# EAGLE design switch (EAGLE 4.16)
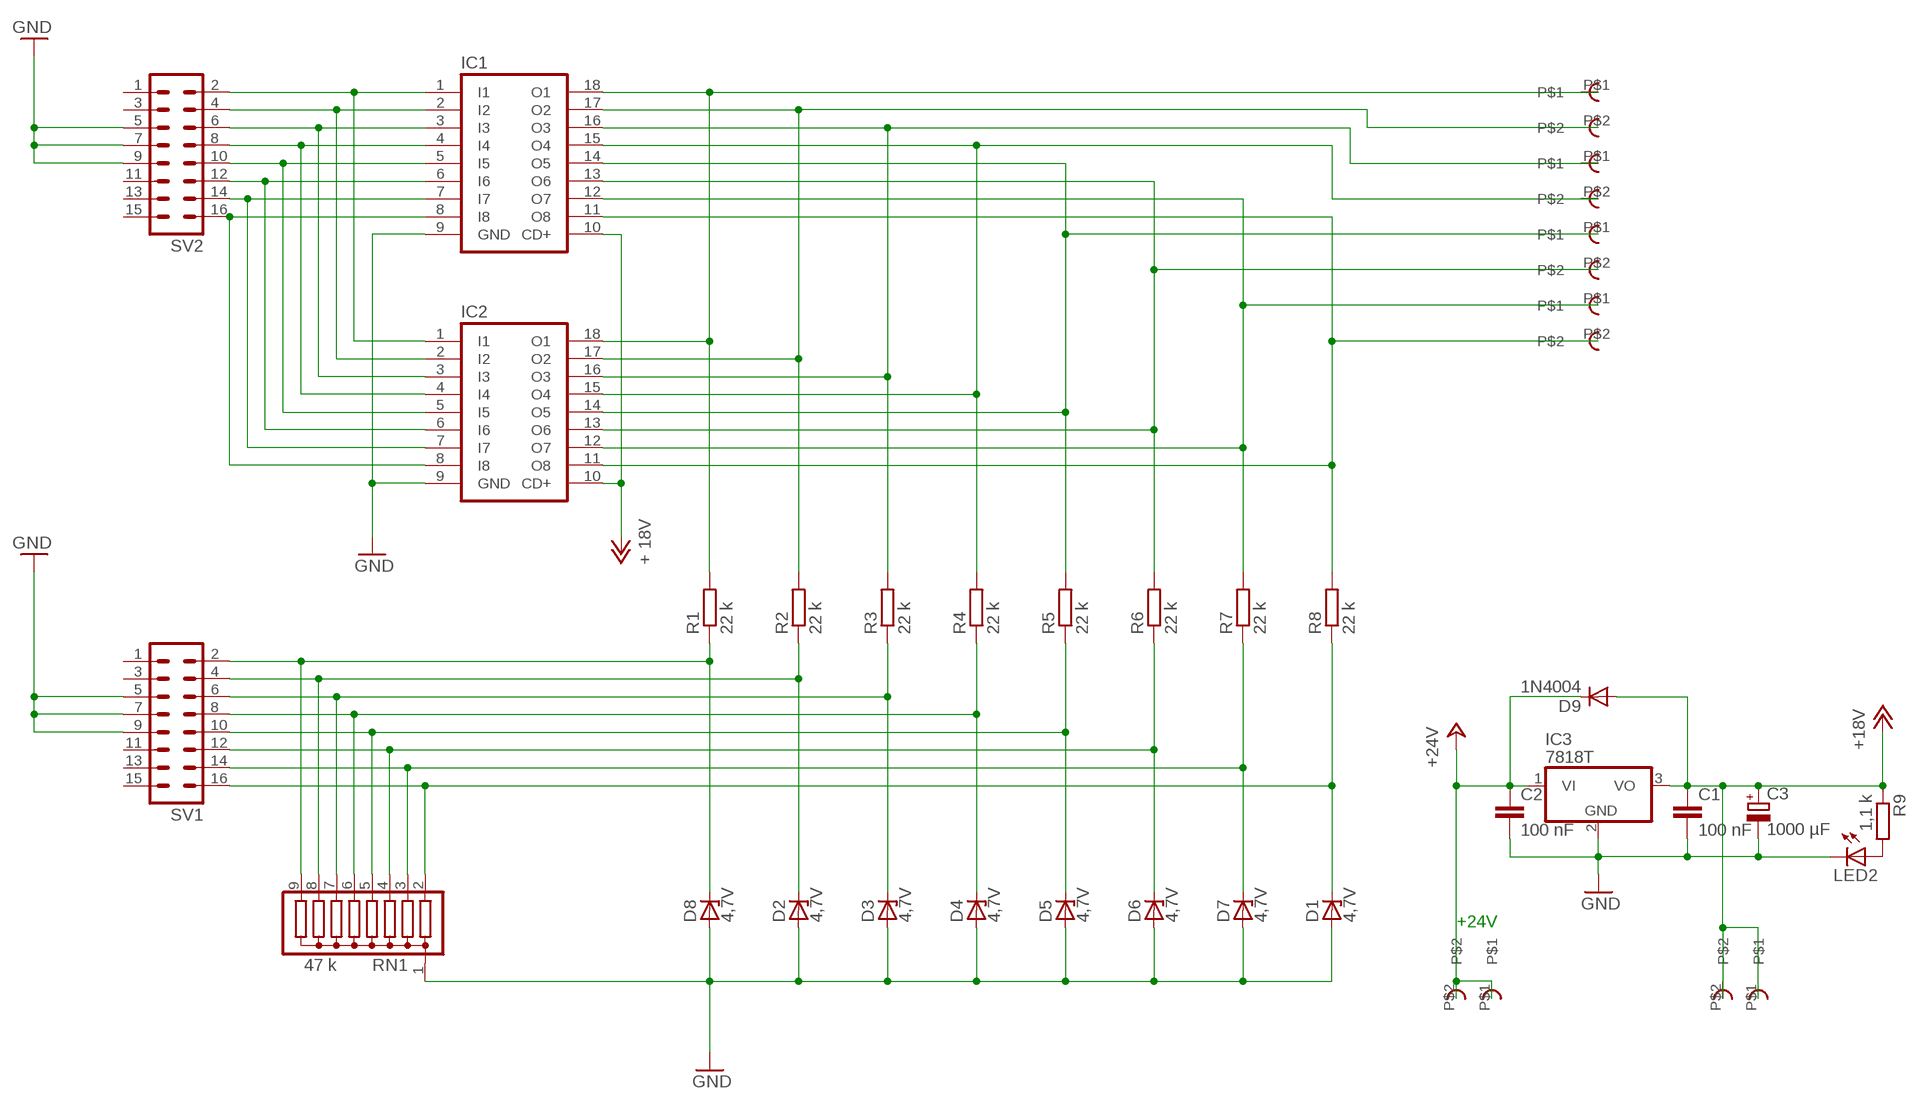
[diagram p0: schematic, sheet 1]

## Parts
+18V  RIACON101-2  [RIACON101-2]
+24V  RIACON101-2  [RIACON101-2]
C1  100 nF  C-EU025-024X044  [C025-024X044]
C2  100 nF  C-EU025-024X044  [C025-024X044]
C3  1000 µF  CPOL-EUE5-10.5  [E5-10,5]
D1  4,7V  ZENER-DIODEDO35Z10  [DO35Z10]
D2  4,7V  ZENER-DIODEDO35Z10  [DO35Z10]
D3  4,7V  ZENER-DIODEDO35Z10  [DO35Z10]
D4  4,7V  ZENER-DIODEDO35Z10  [DO35Z10]
D5  4,7V  ZENER-DIODEDO35Z10  [DO35Z10]
D6  4,7V  ZENER-DIODEDO35Z10  [DO35Z10]
D7  4,7V  ZENER-DIODEDO35Z10  [DO35Z10]
D8  4,7V  ZENER-DIODEDO35Z10  [DO35Z10]
D9  1N4004  [DO41-10]
IC1  ULN2803A  [DIL18]
IC2  ULN2803A  [DIL18]
IC3  7818T  [TO220H]
LED2  LED3MM  [LED3MM]
R1  22 k  R-EU_0207/2V  [0207/2V]
R2  22 k  R-EU_0207/2V  [0207/2V]
R3  22 k  R-EU_0207/2V  [0207/2V]
R4  22 k  R-EU_0207/2V  [0207/2V]
R5  22 k  R-EU_0207/2V  [0207/2V]
R6  22 k  R-EU_0207/2V  [0207/2V]
R7  22 k  R-EU_0207/2V  [0207/2V]
R8  22 k  R-EU_0207/2V  [0207/2V]
R9  1,1 k  R-EU_0204/2V  [0204V]
RN1  47 k  G08R  [SIL9]
SV1  ML16  [ML16]
SV2  ML16  [ML16]
U$1  RIACON101-2  [RIACON101-2]
U$2  RIACON101-2  [RIACON101-2]
U$3  RIACON101-2  [RIACON101-2]
U$4  RIACON101-2  [RIACON101-2]

## Nets
+18V: +18V.P$1 +18V.P$2 C1.1 C3.+ D9.A IC1.10(CD+) IC2.10(CD+) IC3.3(VO) R9.1 ; supply symbol labelled + 18V
+24V: +24V.P$1 +24V.P$2 C2.1 D9.C IC3.1(VI)
GND: C1.2 C2.2 C3.- D1.A D2.A D3.A D4.A D5.A D6.A D7.A D8.A IC1.9(GND) IC2.9(GND) IC3.2(GND) LED2.K(C) RN1.1 SV1.5 SV1.7 SV1.9 SV2.5 SV2.7 SV2.9
N$1: IC1.1(I1) IC2.1(I1) SV2.2
N$2: IC1.2(I2) IC2.2(I2) SV2.4
N$3: IC1.3(I3) IC2.3(I3) SV2.6
N$4: IC1.4(I4) IC2.4(I4) SV2.8
N$5: IC1.5(I5) IC2.5(I5) SV2.10
N$6: IC1.18(O1) IC2.18(O1) R1.2 U$1.P$1
N$7: IC1.6(I6) IC2.6(I6) SV2.12
N$8: IC1.7(I7) IC2.7(I7) SV2.14
N$9: IC1.8(I8) IC2.8(I8) SV2.16
N$10: IC1.17(O2) IC2.17(O2) R2.2 U$1.P$2
N$11: IC1.16(O3) IC2.16(O3) R3.2 U$2.P$1
N$12: IC1.15(O4) IC2.15(O4) R4.2 U$2.P$2
N$13: IC1.14(O5) IC2.14(O5) R5.2 U$3.P$1
N$14: IC1.13(O6) IC2.13(O6) R6.2 U$3.P$2
N$15: IC1.12(O7) IC2.12(O7) R7.2 U$4.P$1
N$16: LED2.A R9.2
N$17: IC1.11(O8) IC2.11(O8) R8.2 U$4.P$2
N$18: D8.C R1.1 RN1.9 SV1.2
N$19: D2.C R2.1 RN1.8 SV1.4
N$20: D3.C R3.1 RN1.7 SV1.6
N$21: D4.C R4.1 RN1.6 SV1.8
N$22: D5.C R5.1 RN1.5 SV1.10
N$23: D6.C R6.1 RN1.4 SV1.12
N$24: D7.C R7.1 RN1.3 SV1.14
N$25: D1.C R8.1 RN1.2 SV1.16
Unconnected: SV1.1 SV1.3 SV1.11 SV1.13 SV1.15 SV2.1 SV2.3 SV2.11 SV2.13 SV2.15

## Notes on the sheet
- +24V

## Library data of the parts
+18V +24V U$1-U$4 = con-riacon101:RIACON101-2: Riaconn Schreaubklemme 101
C1 C2 = rcl:C-EU: CAPACITOR, European symbol
C3 = rcl:CPOL-EU: POLARIZED CAPACITOR, European symbol
D1-D8 = diode:ZENER-DIODE: Z-Diode
D9 = diode:1N4004: DIODE general purpose rectifier, 1 A
IC1 IC2 = uln-udn:ULN2803A: DRIVER ARRAY
IC3 = linear:78*: Positive VOLTAGE REGULATOR Source: http://cache.national.com/ds/LM/LM78L05.pdf http://www.fairchildsemi.com/ds/LM/LM7805.pdf
LED2 = led:LED: LED OSRAM: - CHIPLED LG R971, LG N971, LY N971, LG Q971, LY Q971, LO R971, LY R971 LH N974, LH R974 LS Q976, LO Q976, LY Q976 LO Q996 - Hyper CHIPLED LW Q18S LB Q993, LB Q99A, LB R99A - SideLED LS A670, LO A670, LY A670, LG A670, LP A670 LB A673, LV A673, LT A673, LW A673 LH A674 LY A675 LS A676, LA A676, LO A676, LY A676, LW A676 LS A679, LY A679, LG A679 - Hyper Micro SIDELED® LS Y876, LA Y876, LO Y876, LY Y876 LT Y87S - SmartLED LW L88C, LW L88S LB L89C, LB L89S, LG L890 LS L89K, LO L89K, LY L89K LS L896, LA L896, LO L896, LY L896 - TOPLED LS T670, LO T670, LY T670, LG T670, LP T670 LSG T670, LSP T670, LSY T670, LOP T670, LYG T670 LG T671, LOG T671, LSG T671 LB T673, LV T673, LT T673, LW T673 LH T674 LS T676, LA T676, LO T676, LY T676, LB T676, LH T676, LSB T676, LW T676 LB T67C, LV T67C, LT T67C, LS T67K, LO T67K, LY T67K, LW E67C LS E67B, LA E67B, LO E67B, LY E67B, LB E67C, LV E67C, LT E67C LW T67C LS T679, LY T679, LG T679 LS T770, LO T770, LY T770, LG T770, LP T770 LB T773, LV T773, LT T773, LW T773 LH T774 LS E675, LA E675, LY E675, LS T675 LS T776, LA T776, LO T776, LY T776, LB T776 LHGB T686 LT T68C, LB T68C - Hyper Mini TOPLED® LB M676 - Mini TOPLED Santana® LG M470 LS M47K, LO M47K, LY M47K Source: http://www.osram.convergy.de - LUMILED® LXK2-PW12-R00, LXK2-PW12-S00, LXK2-PW14-U00, LXK2-PW14-V00 LXK2-PM12-R00, LXK2-PM12-S00, LXK2-PM14-U00 LXK2-PE12-Q00, LXK2-PE12-R00, LXK2-PE12-S00, LXK2-PE14-T00, LXK2-PE14-U00 LXK2-PB12-K00, LXK2-PB12-L00, LXK2-PB12-M00, LXK2-PB14-N00, LXK2-PB14-P00, LXK2-PB14-Q00 LXK2-PR12-L00, LXK2-PR12-M00, LXK2-PR14-Q00, LXK2-PR14-R00 LXK2-PD12-Q00, LXK2-PD12-R00, LXK2-PD12-S00 LXK2-PH12-R00, LXK2-PH12-S00 LXK2-PL12-P00, LXK2-PL12-Q00, LXK2-PL12-R00 Source: www.luxeon.com
R1-R9 = rcl:R-EU_: RESISTOR, European symbol
RN1 = resistor-sil:G08R: SIL RESISTOR
SV1 SV2 = con-harting-ml:ML16: HARTING

## Board
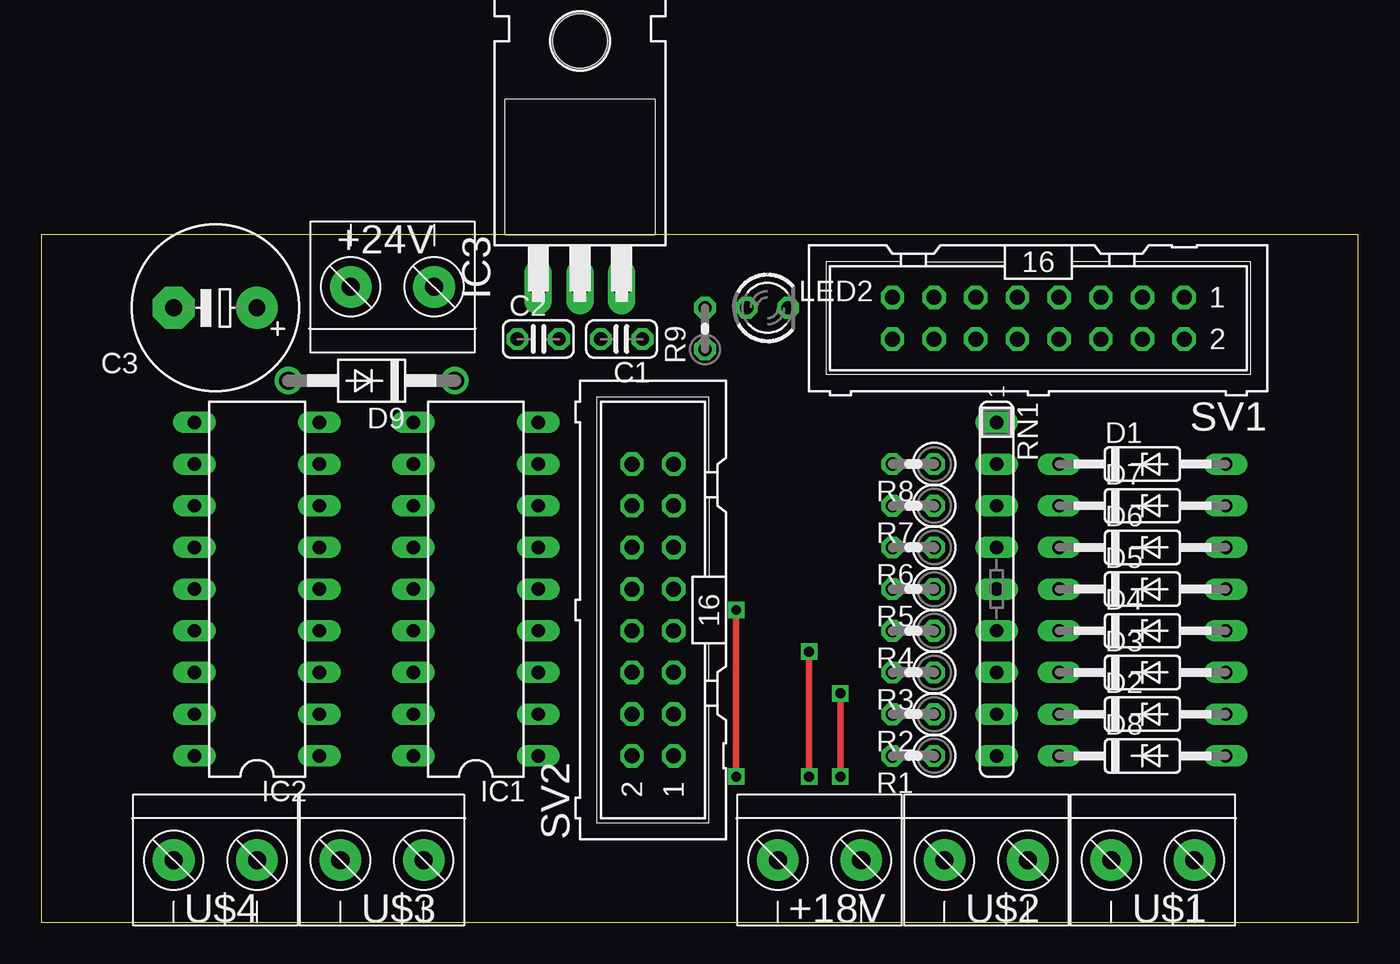
[diagram p1: board, top side]
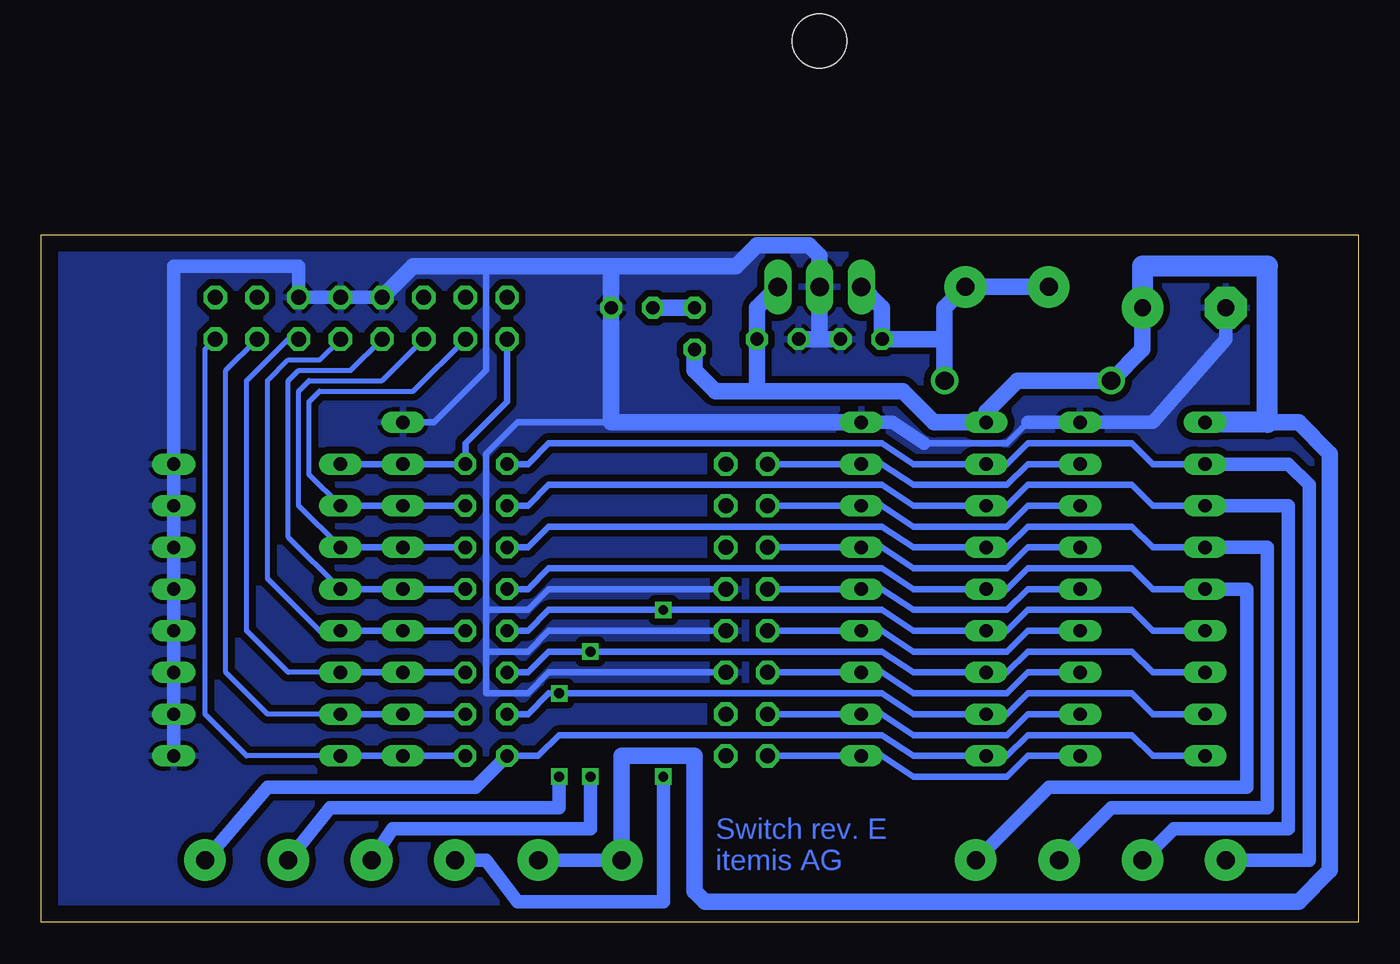
[diagram p2: board, bottom side, seen from below]

Size 80.31 x 41.9 mm. Coordinates in mm from the lower left corner, seen from the top.
Outline: 0,0 80.31,0 80.31,41.9 0,41.9 0,0
Copper layers (1*16): Top 0.035mm / dielectric 1.5mm / Bottom 0.035mm
Design rules "default": minimum track width 10mil, minimum drill 24mil, track to track 8mil, track to pad 8mil, pad to pad 8mil, via to via 8mil, smd to smd 8mil, copper to edge 40mil, drill to drill 8mil, minimum pad ring 10mil, minimum via ring 8mil, stop-mask expansion 4mil, vias tented up to drill 0mil, thermal gap 10mil
tRestrict: area 74.8,3.2 to 79.8,41.3; area -0.2,2.5 to 4.9,40.6
bRestrict: area 25.2,2.5 to 39.8,7

### Footprints (pad centres in the part's own frame; a part is rotated, then mirrored left to right if it is on the bottom)
RIACON101-2 = drill 1.1 pad 2.54 round: P$1 0,2.54; P$2 0,-2.54
C025-024X044 = drill 0.813 octagon: 1 -1.27,0; 2 1.27,0
E5-10,5 = drill 1.016 pad 2.54 round: + -2.54,0 | drill 1.016 pad 2.54 octagon: - 2.54,0
DO35Z10 = drill 0.813 long: A 5.08,0; C -5.08,0
DO41-10 = drill 1.118 round: A 5.08,0; C -5.08,0
DIL18 = drill 0.813 long: 1 -10.16,-3.81; 2 -7.62,-3.81; 3 -5.08,-3.81; 4 -2.54,-3.81; 5 0,-3.81; 6 2.54,-3.81; 7 5.08,-3.81; 8 7.62,-3.81; 9 10.16,-3.81; 10 10.16,3.81; 11 7.62,3.81; 12 5.08,3.81; 13 2.54,3.81; 14 0,3.81; 15 -2.54,3.81; 16 -5.08,3.81; 17 -7.62,3.81; 18 -10.16,3.81
TO220H = drill 1.118 long: 1 -2.54,-10.16; 2 0,-10.16; 3 2.54,-10.16 | hole 3.302: 0,4.826
LED3MM = drill 0.813 octagon: A -1.27,0; K 1.27,0
0207/2V = drill 0.813 octagon: 1 -1.27,0; 2 1.27,0
0204V = drill 0.813 octagon: 1 -1.27,0; 2 1.27,0
SIL9 = drill 0.813 long: 1 -10.16,0; 2 -7.62,0; 3 -5.08,0; 4 -2.54,0; 5 0,0; 6 2.54,0; 7 5.08,0; 8 7.62,0; 9 10.16,0
ML16 = drill 0.914 octagon: 1 -8.89,-1.27; 2 -8.89,1.27; 3 -6.35,-1.27; 4 -6.35,1.27; 5 -3.81,-1.27; 6 -3.81,1.27; 7 -1.27,-1.27; 8 -1.27,1.27; 9 1.27,-1.27; 10 1.27,1.27; 11 3.81,-1.27; 12 3.81,1.27; 13 6.35,-1.27; 14 6.35,1.27; 15 8.89,-1.27; 16 8.89,1.27

### Placement (x,y rotation side)
+18V  47.46,3.8 270 top
+24V  21.42,38.73 90 top
C1  35.39,35.55 180 top
C2  30.31,35.55 0 top
C3  10.63,37.46 180 top
D1  67.14,27.94 0 top
D2  67.14,12.7 0 top
D3  67.14,15.24 0 top
D4  67.14,17.78 0 top
D5  67.14,20.32 0 top
D6  67.14,22.86 0 top
D7  67.14,25.39 0 top
D8  67.14,10.16 0 top
D9  20.15,33.02 180 top
IC1  26.5,20.32 90 top
IC2  13.17,20.32 90 top
IC3  32.85,48.89 0 top
LED2  44.28,37.46 0 top
R1  53.17,10.16 180 top
R2  53.17,12.7 180 top
R3  53.17,15.24 180 top
R4  53.17,17.78 180 top
R5  53.17,20.32 180 top
R6  53.17,22.86 180 top
R7  53.17,25.39 180 top
R8  53.17,27.94 180 top
R9  40.48,36.19 90 top
RN1  58.25,20.32 270 top
SV1  60.8,36.83 180 top
SV2  37.3,19.05 90 top
U$1  67.78,3.8 270 top
U$2  57.62,3.8 270 top
U$3  20.79,3.8 270 top
U$4  10.63,3.8 270 top

### Tracks (layer width: path | path; a pad name or v marks a point on that pad's centre or on a via)
+18V
  Bottom 0.813: +18V.P$2 +18V.P$1
  Bottom 1.016: IC3.3 36.66,37.46 C1.1 36.66,32.38 | C3.+ 13.17,34.92 D9.A 20.79,33.02 22.7,31.11 IC1.10 25.87,30.48 27.77,32.38 36.66,32.38 | +18V.P$2 44.92,10.16 40.48,10.16 40.48,1.9 39.84,1.26 3.64,1.26 1.74,3.17 1.74,28.57 3.64,30.48 5.55,30.48 | 36.66,32.38 39.2,32.38 40.48,33.65 R9.1
  Bottom 1.27: IC2.10 5.55,30.48 5.55,40 13.17,40 C3.+
+24V
  Bottom 1.016: D9.C 25.23,35.55 | 25.23,35.55 25.23,37.46 +24V.P$2 +24V.P$1 | IC3.1 29.04,37.46 C2.1 25.23,35.55
GND
  Bottom 0.406: 20.15,30.48 21.42,29.21 26.5,29.21 | RN1.1 56.35,30.48 53.17,33.65 53.17,40 | SV2.5 49.37,15.24 50.63,13.96 53.17,13.96 53.17,16.5 | 53.17,19.05 53.17,28.57 51.27,30.48 45.55,30.48 | 53.17,19.05 53.17,16.5 | SV2.7 49.37,17.78 50.63,16.5 53.17,16.5 | SV2.9 49.37,20.32 50.63,19.05 53.17,19.05
  Bottom 0.813: D8.A D2.A D3.A D4.A D5.A D6.A D7.A D1.A 72.22,40 64.61,40 SV1.5 SV1.7 SV1.9 | C3.- 8.09,35.55 12.54,30.48 IC2.9 20.15,30.48 | 26.5,29.21 28.41,30.48 IC1.9
  Bottom 1.016: 45.55,40 53.17,40 57.62,40 SV1.9 | 45.55,40 LED2.K 45.55,30.48 IC1.9 | 32.85,35.55 C2.2 | 32.85,35.55 C1.2 | 32.85,35.55 IC3.2 32.85,40.63 33.49,41.27 36.66,41.27 37.94,40 45.55,40
  pour Bottom (isolate 0.406): -0.17,41.91 80.48,41.91 80.48,-0.01 -0.17,-0.01
N$1
  Bottom 0.406: IC2.1 20.15,10.16 21.42,8.88 27.14,8.88 29.04,10.16 IC1.1 SV2.2
N$2
  Bottom 0.406: IC2.2 20.15,12.7 21.42,11.43 27.14,11.43 29.04,12.7 IC1.2 SV2.4
N$3
  Bottom 0.406: IC2.3 20.15,15.24 21.42,13.96 27.14,13.96 29.04,15.24 IC1.3 SV2.6
N$4
  Bottom 0.406: IC2.4 20.15,17.78 21.42,16.5 27.14,16.5 29.04,17.78 IC1.4 SV2.8
N$5
  Bottom 0.406: IC2.5 20.15,20.32 21.42,19.05 27.14,19.05 29.04,20.32 IC1.5 SV2.10
N$6
  Bottom 0.406: IC2.18 12.54,10.16 13.81,11.43 20.15,11.43 21.42,10.16 IC1.18 27.14,10.16 29.04,11.43 48.73,11.43 50,10.16 R1.2
  Bottom 0.813: R1.2 53.81,8.25 66.51,8.25 U$1.P$1
N$7
  Bottom 0.406: IC2.6 20.15,22.86 21.42,21.59 27.14,21.59 29.04,22.86 IC1.6 SV2.12
N$8
  Bottom 0.406: IC2.7 20.15,25.39 21.42,24.12 27.14,24.12 29.04,25.39 IC1.7 SV2.14
N$9
  Bottom 0.406: IC2.8 20.15,27.94 21.42,26.66 27.14,26.66 29.04,27.94 IC1.8 SV2.16
N$10  (via drill 0.6)
  Top 0.406: v48.73,13.96 v48.73,8.88
  Bottom 0.406: IC2.17 12.54,12.7 13.81,13.96 20.15,13.96 21.42,12.7 IC1.17 27.14,12.7 29.04,13.96 v48.73,13.96 49.37,13.96 50.63,12.7 R2.2
  Bottom 0.813: U$1.P$2 62.7,6.98 48.73,6.98 v48.73,8.88
N$11  (via drill 0.6)
  Top 0.406: v46.82,16.5 v46.82,8.88
  Bottom 0.406: IC2.16 12.54,15.24 13.81,16.5 20.15,16.5 21.42,15.24 IC1.16 27.14,15.24 29.04,16.5 v46.82,16.5 49.37,16.5 50.63,15.24 R3.2
  Bottom 0.813: U$2.P$1 58.89,5.71 46.82,5.71 v46.82,8.88
N$12  (via drill 0.6)
  Top 0.406: v42.38,19.05 v42.38,8.88
  Bottom 0.406: IC2.15 12.54,17.78 13.81,19.05 20.15,19.05 21.42,17.78 IC1.15 27.14,17.78 29.04,19.05 v42.38,19.05 49.37,19.05 50.63,17.78 R4.2
  Bottom 0.813: U$2.P$2 53.17,3.8 51.27,1.26 42.38,1.26 v42.38,8.88
N$13
  Bottom 0.406: IC2.14 12.54,20.32 13.81,21.59 20.15,21.59 21.42,20.32 IC1.14 27.14,20.32 29.04,21.59 49.37,21.59 50.63,20.32 R5.2
  Bottom 0.813: U$3.P$1 18.88,8.25 6.82,8.25 6.82,20.32 IC2.14
N$14
  Bottom 0.406: IC2.13 12.54,22.86 13.81,24.12 20.15,24.12 21.42,22.86 IC1.13 27.14,22.86 29.04,24.12 49.37,24.12 50.63,22.86 R6.2
  Bottom 0.813: U$3.P$2 15.08,6.98 5.55,6.98 5.55,22.86 IC2.13
N$15
  Bottom 0.406: IC2.12 12.54,25.39 13.81,26.66 20.15,26.66 21.42,25.39 IC1.12 27.14,25.39 29.04,26.66 49.37,26.66 50.63,25.39 R7.2
  Bottom 0.813: U$4.P$1 11.27,5.71 4.28,5.71 4.28,25.39 IC2.12
N$16
  Bottom 1.016: R9.2 LED2.A
N$17
  Bottom 0.406: IC2.11 12.54,27.94 13.81,29.21 20.15,29.21 21.42,27.94 IC1.11 27.14,27.94 29.04,29.21 49.37,29.21 50.63,27.94 R8.2
  Bottom 0.813: U$4.P$2 3.01,3.8 3.01,26.66 4.28,27.94 IC2.11
N$18
  Bottom 0.305: SV1.2 70.32,34.92 70.32,12.7 67.78,10.16 D8.C
  Bottom 0.406: R1.1 RN1.9 D8.C
N$19
  Bottom 0.305: SV1.4 69.05,33.65 69.05,15.24 66.51,12.7 D2.C
  Bottom 0.406: R2.1 RN1.8 D2.C
N$20
  Bottom 0.305: SV1.6 65.24,35.55 67.78,33.02 67.78,17.78 65.24,15.24 D3.C
  Bottom 0.406: R3.1 RN1.7 D3.C
N$21
  Bottom 0.305: SV1.8 63.34,34.29 65.24,34.29 66.51,33.02 66.51,20.95 63.34,17.78 D4.C
  Bottom 0.406: R4.1 RN1.6 D4.C
N$22
  Bottom 0.305: SV1.10 61.43,33.65 64.61,33.65 65.24,33.02 65.24,23.49 D5.C
  Bottom 0.406: R5.1 RN1.5 D5.C
N$23
  Bottom 0.305: SV1.12 59.52,33.02 63.97,33.02 64.61,32.38 64.61,25.39 D6.C
  Bottom 0.406: R6.1 RN1.4 D6.C
N$24
  Bottom 0.305: SV1.14 57.62,32.38 63.34,32.38 63.97,31.75 63.97,27.3 D7.C
  Bottom 0.406: R7.1 RN1.3 D7.C
N$25
  Bottom 0.406: D1.C RN1.2 R8.1 54.45,29.21 51.91,31.75 SV1.16

### Text on the board
Bottom: Switch rev. E | itemis AG